# EAGLE design pot-boardC (EAGLE 6.6.0)
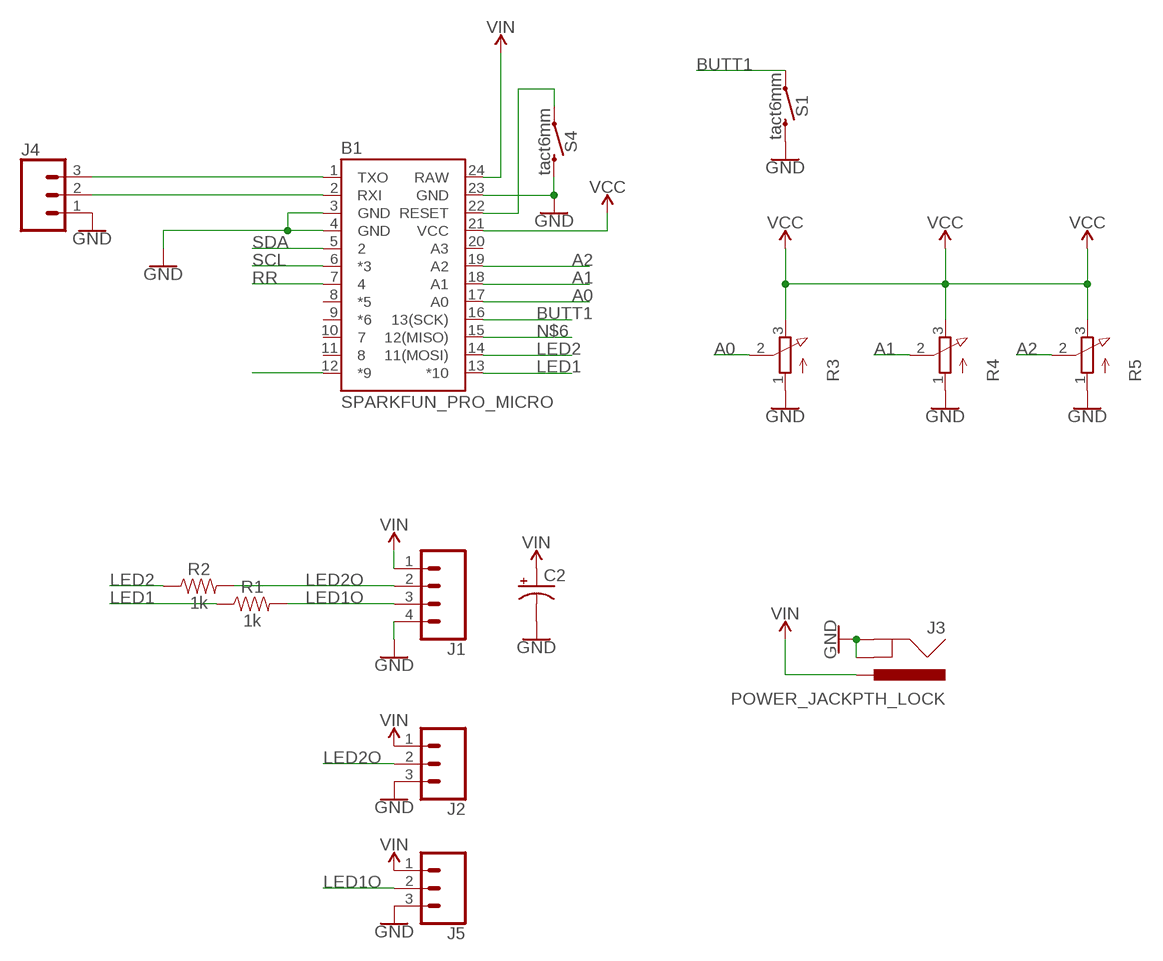
[diagram p0: schematic, sheet 1]

## Parts
B1  SPARKFUN_PRO_MICRO  [SPARKFUN_PRO_MICRO]
C2  CPOL-USE3.5-8  [E3,5-8]
J1  CONN_04  [1X04]
J2  CONN_03  [1X03]
J3  POWER_JACKPTH_LOCK  [POWER_JACK_PTH_LOCK]
J4  CONN_03  [1X03]
J5  CONN_03  [1X03]
R1  1k  1KOHM-HORIZ-1/4W-5%  [AXIAL-0.3]
R2  1k  1KOHM-HORIZ-1/4W-5%  [AXIAL-0.3]
R3  3RP/1610N  [3RP/1610N]
R4  3RP/1610N  [3RP/1610N]
R5  3RP/1610N  [3RP/1610N]
S1  tact6mm  MOMENTARY-SWITCH-SPST-PTH-6.0MM  [TACTILE_SWITCH_PTH_6.0MM]
S4  tact6mm  MOMENTARY-SWITCH-SPST-PTH-6.0MM  [TACTILE_SWITCH_PTH_6.0MM]

## Nets
A0: B1.17(A0) R3.2(S)
A1: B1.18(A1) R4.2(S)
A2: B1.19(A2) R5.2(S)
BUTT1: B1.16(13(SCK)) S1.1
GND: B1.3(GND) B1.4(GND) B1.23(GND) C2.- J1.4 J2.3 J3.GND J3.GNDBREAK J4.1 J5.3 R3.1(A) R4.1(A) R5.1(A) S1.3 S4.3
LED1: B1.13(*10) R1.P$1
LED1O: J1.3 J5.2 R1.P$2
LED2: B1.14(11(MOSI)) R2.P$1
LED2O: J1.2 J2.2 R2.P$2
N$3: B1.2(RXI) J4.2
N$4: B1.1(TXO) J4.3
N$5: B1.12(*9)
N$6: B1.15(12(MISO))
RESET: B1.22(RESET) S4.1
RR: B1.7
SCL: B1.6(*3)
SDA: B1.5
VCC: B1.21(VCC) R3.3(E) R4.3(E) R5.3(E)
VIN: B1.24(RAW) C2.+ J1.1 J2.1 J3.PWR J5.1
Unconnected: B1.8(*5) B1.9(*6) B1.10 B1.11 B1.20(A3)

## Library data of the parts
B1 = SparkFun-Boards:SPARKFUN_PRO_MICRO: SparkFun Pro Micro Atmega32U4 compatible footprint. SparkFun Products: 3.3V/8MHz <https://www.sparkfun.com/products/12587> 5V/16MHz <https://www.sparkfun.com/products/12640>
C2 = adafruit:CPOL-US: POLARIZED CAPACITOR, American symbol
J1 = SparkFun-Connectors:CONN_04: Multi connection point. Often used as Generic Header-pin footprint for 0.1 inch spaced/style header connections On any of the 0.1 inch spaced packages, you can populate with these: Break Away Headers - Straight <https://www.sparkfun.com/products/116> (PRT-00116) Break Away Male Headers - Right Angle <https://www.sparkfun.com/products/553> (PRT-00553) Female Headers <https://www.sparkfun.com/products/115> (PRT-00115) Break Away Headers - Machine Pin <https://www.sparkfun.com/products/117> (PRT-00117) Break Away Female Headers - Swiss Machine Pin <https://www.sparkfun.com/products/743> (PRT-00743) For SCREWTERMINALS and SPRING TERMINALS visit here: Screw Terimnals on SparkFun.com <https://www.sparkfun.com/search/results?term=Screw+Terminals> (5mm/3.5mm/2.54mm spacing) This device is also useful as a general connection point to wire up your design to another part of your project. Our various solder wires solder well into these plated through hole pads. Hook-Up Wire - Assortment (Stranded, 22 AWG) <https://www.sparkfun.com/products/11375> (PRT-11375) Hook-Up Wire - Assortment (Solid Core, 22 AWG) <https://www.sparkfun.com/products/11367> (PRT-11367) View the entire wire category on our website here <https://www.sparkfun.com/categories/141> Special notes: Molex polarized connector foot print use with SKU : PRT-08231 with associated crimp pins and housings. 1MM SMD Version SKU: PRT-10208; PROD_ID: CONN-09696
J2 J4 J5 = SparkFun-Connectors:CONN_03: Multi connection point. Often used as Generic Header-pin footprint for 0.1 inch spaced/style header connections On any of the 0.1 inch spaced packages, you can populate with these: Break Away Headers - Straight <https://www.sparkfun.com/products/116> (PRT-00116) Break Away Male Headers - Right Angle <https://www.sparkfun.com/products/553> (PRT-00553) Female Headers <https://www.sparkfun.com/products/115> (PRT-00115) Break Away Headers - Machine Pin <https://www.sparkfun.com/products/117> (PRT-00117) Break Away Female Headers - Swiss Machine Pin <https://www.sparkfun.com/products/743> (PRT-00743) Stackable Header - 3 Pin (Female, 0.1") <https://www.sparkfun.com/products/13875> (PRT-13875) For SCREWTERMINALS and SPRING TERMINALS visit here: Screw Terimnals on SparkFun.com <https://www.sparkfun.com/search/results?term=Screw+Terminals> (5mm/3.5mm/2.54mm spacing) This device is also useful as a general connection point to wire up your design to another part of your project. Our various solder wires solder well into these plated through hole pads. Hook-Up Wire - Assortment (Stranded, 22 AWG) <https://www.sparkfun.com/products/11375> (PRT-11375) Hook-Up Wire - Assortment (Solid Core, 22 AWG) <https://www.sparkfun.com/products/11367> (PRT-11367) View the entire wire category on our website here <https://www.sparkfun.com/categories/141> Special notes: Molex polarized connector foot print use with SKU : PRT-08232 with associated crimp pins and housings.
J3 = SparkFun-Connectors:POWER_JACK: Power Jack Connector This is the standard 5.5mm barrel jack for power. The PTH is the most common, proven, reliable, footprint. The Slot footprint only works if the mill layer is transmitted to the PCB fab house so be warned. Here are the connectors we sell at SparkFun: DC Barrel Power Jack/Connector <https://www.sparkfun.com/products/119> (PRT-00119) DC Barrel Power Jack/Connector (SMD) <https://www.sparkfun.com/products/12748> (PRT-12748) DC Barrel Jack Adapter - Breadboard Compatible <https://www.sparkfun.com/products/10811> (PRT-10811) It is used on this SparkFun product (and many, many others): SparkFun RedBoard - Programmed with Arduino <https://www.sparkfun.com/products/12757> (DEV-12757) Also, if you need a mating power supply or connector, please check these out: Wall Adapter Power Supply - 9VDC 650mA <https://www.sparkfun.com/products/298> (TOL-00298) DC Barrel Jack Adapter - Male <https://www.sparkfun.com/products/10287> (PRT-10287); PROD_ID: CONN-08197; SF_ID: PRT-00119
R1 R2 = SparkFun-Resistors:1KOHM: 1kΩ resistor A resistor is a passive two-terminal electrical component that implements electrical resistance as a circuit element. Resistors act to reduce current flow, and, at the same time, act to lower voltage levels within circuits. - Wikipedia; PROD_ID: RES-08380
R3-R5 = pot:3RP/1610N: 16mm Potentiometer one level Source: http://www.alphapotentiometers.net/html/16mm_pot_2.html
S1 S4 = SparkFun-Switches:MOMENTARY-SWITCH-SPST: Momentary Switch (Pushbutton) - SPST Normally-open (NO) SPST momentary switches (buttons, pushbuttons). Variants PTH-12MM - 12mm square, through-hole Momentary Pushbutton Switch - 12mm Square <https://www.sparkfun.com/products/9190> (COM-09190) PTH-6.0MM, PTH-6.0MM-KIT - 6.0mm square, through-hole Mini Pushbutton Switch <https://www.sparkfun.com/products/97> (COM-00097) KIT package intended for soldering kit's - only one side of pads' copper is exposed. PTH-RIGHT-ANGLE-KIT - Right-angle, through-hole Right Angle Tactile Button <https://www.sparkfun.com/products/10791> - Used on SparkFun BigTime Watch Kit <https://www.sparkfun.com/products/11734> SMD-12MM - 12mm square, surface-mount Tactile Button - SMD (12mm) <https://www.sparkfun.com/products/12993> (COM-12993) Used on SparkFun PicoBoard <https://www.sparkfun.com/products/11888> SMD-4.5MM - 4.5mm Square Trackball Switch Used on SparkFun Blackberry Trackballer Breakout <https://www.sparkfun.com/products/13169> SMD-4.6MMX2.8MM - 4.60mm x 2.80mm, surface mount Used on SparkFun SAMD21 Mini Breakout <https://www.sparkfun.com/products/13664> SMD-5.2MM, SMD-5.2-REDUNDANT - 5.2mm square, surface-mount Mini Pushbutton Switch - SMD <https://www.sparkfun.com/products/8720> (COM-08720) Used on Arduino Pro Mini <https://www.sparkfun.com/products/11114> REDUNDANT package connects both switch circuits together SMD-6.0X3.5MM - 6.0 x 3.5mm, surface mount Momentary Reset Switch SMD <https://www.sparkfun.com/products/8229> (COM-08229) SMD-6.2MM-TALL - 6.2mm square, surface mount Tactile Button - SMD (6mm) <https://www.sparkfun.com/products/12992> Used on SparkFun Digital Sandbox <https://www.sparkfun.com/products/12651> SMD-RIGHT-ANGLE - Right-angle, surface mount Used on SparkFun Block for Intel® Edison - Arduino <https://www.sparkfun.com/products/13036>; PROD_ID: SWCH-08441; SF_SKU: COM-00097

## Board
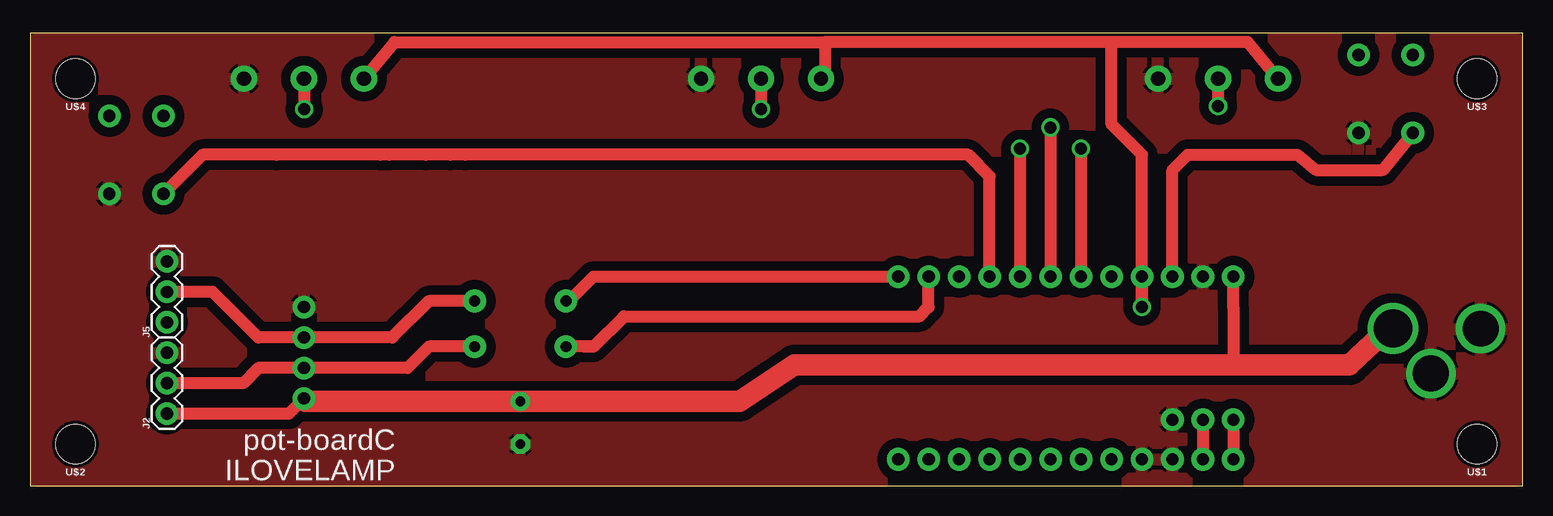
[diagram p1: board, top side]
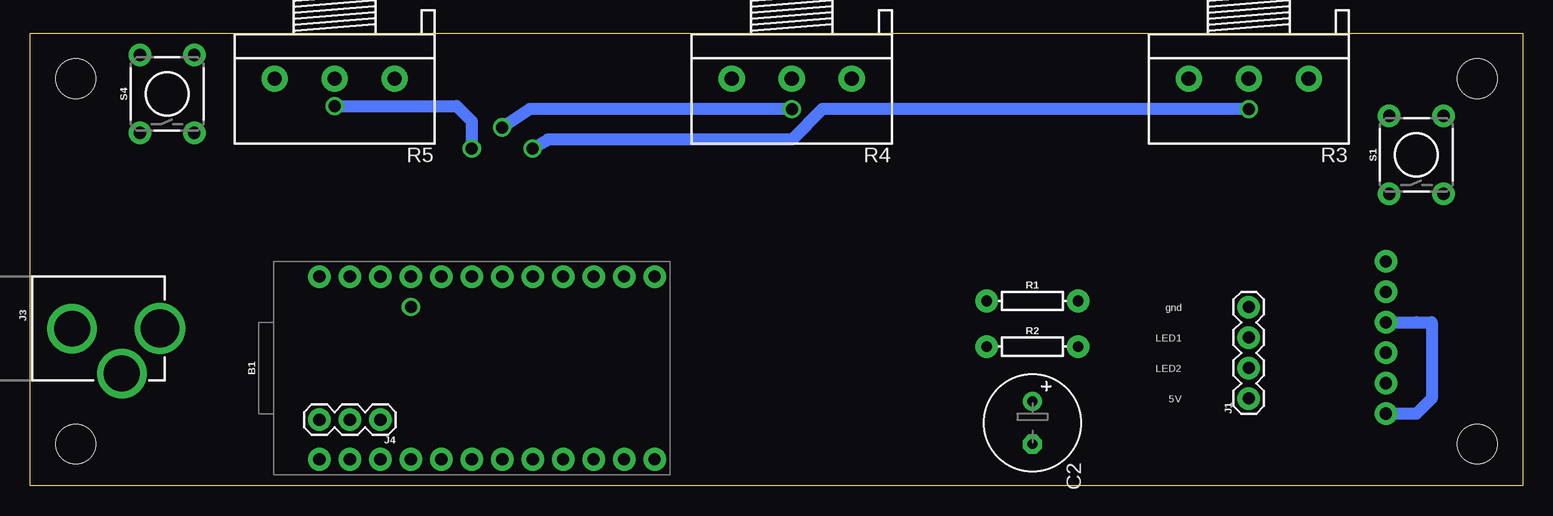
[diagram p2: board, bottom side, seen from below]

Size 124.44 x 37.77 mm. Coordinates in mm from the lower left corner, seen from the top.
Outline: 124.44,37.77 0,37.77 0,0 124.44,0 124.44,37.77
Copper layers (1*16): Top 0.035mm / dielectric 1.5mm / Bottom 0.035mm
Design rules "OthermillDRC_1_32_v2": minimum track width 8mil, minimum drill 0.8mm, track to track 0.794003125mm, track to pad 0.794003125mm, pad to pad 0.794003125mm, via to via 0.794003125mm, smd to smd 0mil, copper to edge 0mil, drill to drill 1mil, minimum pad ring 10mil, minimum via ring 10mil, stop-mask expansion 1mil, vias tented up to drill 30mil, thermal gap 10mil

### Footprints (pad centres in the part's own frame; a part is rotated, then mirrored left to right if it is on the bottom)
SPARKFUN_PRO_MICRO = drill 1.016 pad 1.88: 1 -7.62,12.7; 2 -7.62,10.16; 3 -7.62,7.62; 4 -7.62,5.08; 5 -7.62,2.54; 6 -7.62,0; 7 -7.62,-2.54; 8 -7.62,-5.08; 9 -7.62,-7.62; 10 -7.62,-10.16; 11 -7.62,-12.7; 12 -7.62,-15.24; 13 7.62,-15.24; 14 7.62,-12.7; 15 7.62,-10.16; 16 7.62,-7.62; 17 7.62,-5.08; 18 7.62,-2.54; 19 7.62,0; 20 7.62,2.54; 21 7.62,5.08; 22 7.62,7.62; 23 7.62,10.16; 24 7.62,12.7
E3,5-8 = drill 0.813 pad 1.6: + -1.778,0 | drill 0.813 pad 1.6 octagon: - 1.778,0
1X04 = drill 1.016 pad 1.88: 1 0,0; 2 2.54,0; 3 5.08,0; 4 7.62,0
1X03 = drill 1.016 pad 1.88: 1 0,0; 2 2.54,0; 3 5.08,0
POWER_JACK_PTH_LOCK = drill 2.997 pad 4.115: GND 0.025,6.557; GNDBREAK 3.762,10.7 | drill 3.2 pad 4.115: PWR 0,13.878
AXIAL-0.3 = drill 0.9 pad 1.88: P$1 -3.81,0; P$2 3.81,0
3RP/1610N = drill 1.2 pad 2.184: 1 -5,0; 2 0,0; 3 5,0
TACTILE_SWITCH_PTH_6.0MM = drill 1.016 pad 1.88: 1 -3.251,2.261; 2 3.251,2.261; 3 -3.251,-2.261; 4 3.251,-2.261
STAND-OFF = hole 3.302: 0,0

### Placement (x,y rotation side)
B1  87.61,9.83 90 bottom
C2  40.87,5.26 270 bottom
J1  22.84,7.29 90 bottom
J2  11.41,6.02 90 top
J3  127.49,13.13 270 bottom
J4  95.23,5.51 180 bottom
J5  11.41,13.64 90 top
R1  40.87,15.42 0 bottom
R2  40.87,11.61 0 bottom
R3  22.84,33.96 180 bottom
R4  60.94,33.96 180 bottom
R5  99.04,33.96 180 bottom
S1  8.87,27.61 90 bottom
S4  113.01,32.69 90 bottom
U$1  [STAND-OFF]  120.63,3.48 180 top
U$2  [STAND-OFF]  3.79,3.48 180 top
U$3  [STAND-OFF]  120.63,33.96 180 top
U$4  [STAND-OFF]  3.79,33.96 180 top

### Tracks (layer width: path | path; a pad name or v marks a point on that pad's centre or on a via)
A0  (via drill 1)
  Top 1.016: R3.2 v22.84,31.42 | v82.53,28.12 B1.17
  Bottom 1.016: v22.84,31.42 58.4,31.42 60.94,28.88 81.26,28.88 v82.53,28.12
A1  (via drill 1)
  Top 1.016: R4.2 v60.94,31.42 | v85.07,29.9 B1.18
  Bottom 1.016: v60.94,31.42 74.91,31.42 81.26,31.42 82.78,31.42 v85.07,29.9
A2  (via drill 1)
  Top 1.016: R5.2 v99.04,31.67 | v87.61,28.12 B1.19
  Bottom 1.016: v99.04,31.67 88.88,31.67 87.61,30.4 v87.61,28.12
BUTT1
  Top 1.016: B1.16 79.99,25.83 78.21,27.61 36.3,27.61 35.03,27.61 33,27.61 29.95,27.61 29.19,27.61 20.55,27.61 14.38,27.61 S1.1
GND
  pour Top: 0.49,0.43 123.93,0.43 123.93,37.26 0.49,37.26
LED1
  Top 1.016: B1.13 46.97,17.45 44.94,15.42 R1.P$1
LED1O
  Top 1.016: R1.P$2 33.25,15.42 30.21,12.37 J1.3 19.03,12.37 15.22,16.18 J5.2
LED2
  Top 1.016: 46.21,11.61 46.97,11.61 | 46.97,11.61 46.21,11.61 | 46.21,11.61 R2.P$1 | B1.14 74.91,14.91 74.15,14.15 49.51,14.15 46.97,11.61 | 46.21,11.61 46.97,11.61
LED2O
  Top 1.016: R2.P$2 33.25,11.61 31.48,9.83 J1.2 19.03,9.83 17.76,8.56 J2.2
N$3
  Top 1.016: J4.2 B1.2
N$4
  Top 1.016: J4.3 B1.1
RESET
  Top 1.016: B1.22 95.23,26.34 96.5,27.61 105.64,27.61 107.19,26.34 112.78,26.34 S4.1
VCC  (via drill 1)
  Top 1.016: R3.3 30.38,37.01 66.27,37.01 | 66.27,37.01 66.27,33.96 R4.3 | R5.3 101.5,37.01 90.15,37.01 | 90.15,37.01 66.27,37.01 | B1.21 v92.69,14.91 92.69,27.61 90.15,30.15 90.15,37.01
VIN
  Top 1.016: B1.24 100.31,14.91 100.31,10.08 | J1.1 21.57,6.02 J2.1
  Top 1.778: 113.86,13.13 112.59,12.53 109.96,10.08 103.87,10.08 100.31,10.08 63.73,10.08 59.16,7.04 45.95,7.04 | 45.95,7.04 35.54,7.04 31.73,7.04 23.09,7.04 arc-90 J1.1 | 45.95,7.04 C2.+
  Top 2.54: J3.PWR 113.86,13.13
  Bottom 1.016: J5.1 8.87,13.64 7.6,13.64 7.6,7.29 8.87,6.02 J2.1

### Text on the board
tPlace: pot-boardC | ILOVELAMP
bPlace: gnd | LED1 | LED2 | 5V